# Altium project Electrode_Breakout.PrjPcb
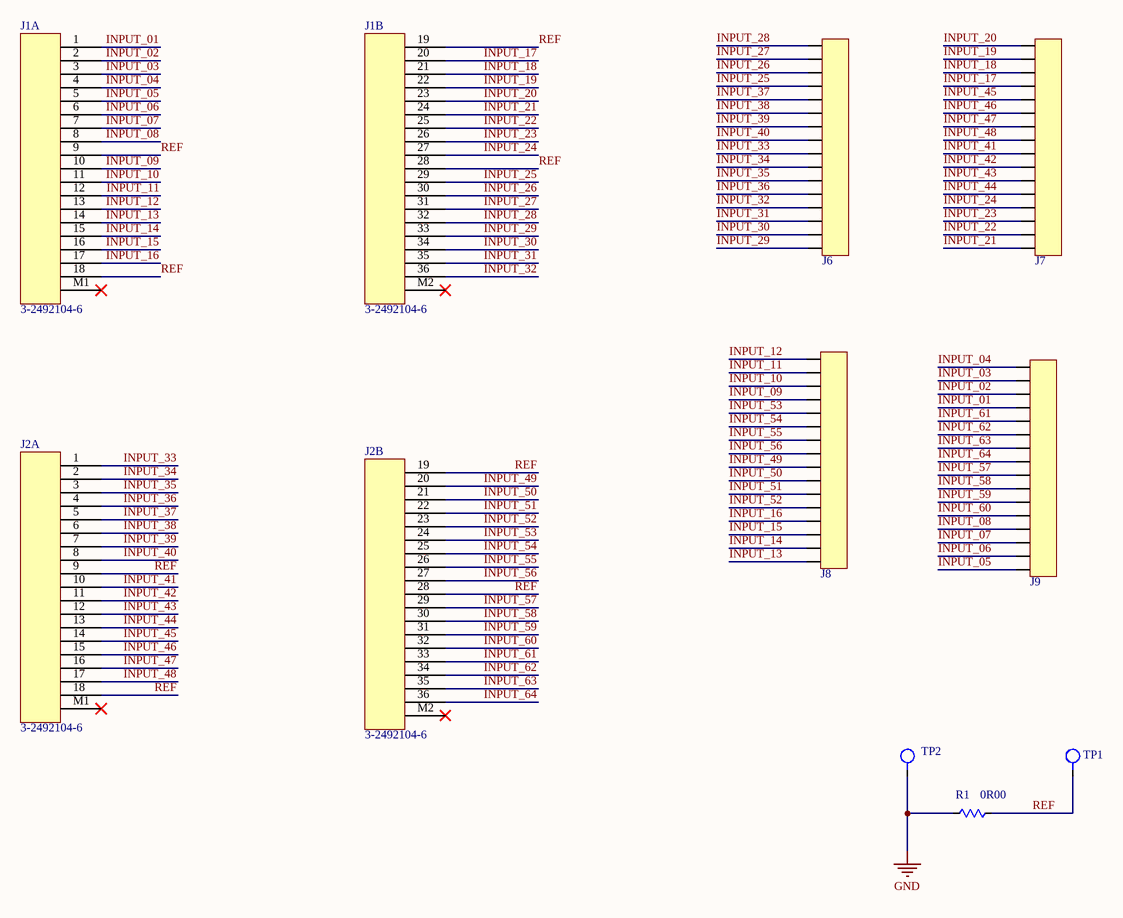
[diagram p0: Electrode_Breakout.SchDoc]
Project_Stencil_Top_Thickness: 0.1 MM; Project_Stencil_Bot_Thickness: 0.1 MM; Project_Revision: 1.000; Project_Name: Electrode Breakout; Project_Group: SBioML; Project_Global: UHDEMG; Project_Designer4: Enter Name; Project_Designer3: Enter Name; Project_Designer2: Enter Name; Project_Designer1: Olivier Bergeron; Project_DateCode: DC260901; Project_Date: 2026-09-01
1 sheet, 9 parts. Net scope: flat (ports and power ports of the same name join across sheets).
Board file: Electrode_Breakout.PcbDoc

## Sheet Electrode_Breakout.SchDoc
size Tabloid; SheetNumber: 1; SheetTotal: 1; Sheet_Name: Electrode Breakout; Size: 11x17

### Parts
J1  3-2492104-6  [CON_ZIF_RA_36POS]  (parts A,B of 2)
J2  3-2492104-6  [CON_ZIF_RA_36POS]  (parts A,B of 2)
J6  CON_HEADER_16  [CON_HEADER_16]  (value not drawn)
J7  CON_HEADER_16  [CON_HEADER_16]  (value not drawn)
J8  CON_HEADER_16  [CON_HEADER_16]  (value not drawn)
J9  CON_HEADER_16  [CON_HEADER_16]  (value not drawn)
R1  0R00  [0402_Resistor]
TP1  TP_Small  [TP_Small_M2]  (value not drawn)
TP2  TP_Small  [TP_Small_M2]  (value not drawn)

### Nets
GND: R1.1 TP2.1
INPUT_01: J1.1 J9.4
INPUT_02: J1.2 J9.3
INPUT_03: J1.3 J9.2
INPUT_04: J1.4 J9.1
INPUT_05: J1.5 J9.16
INPUT_06: J1.6 J9.15
INPUT_07: J1.7 J9.14
INPUT_08: J1.8 J9.13
INPUT_09: J1.10 J8.4
INPUT_10: J1.11 J8.3
INPUT_11: J1.12 J8.2
INPUT_12: J1.13 J8.1
INPUT_13: J1.14 J8.16
INPUT_14: J1.15 J8.15
INPUT_15: J1.16 J8.14
INPUT_16: J1.17 J8.13
INPUT_17: J1.20 J7.4
INPUT_18: J1.21 J7.3
INPUT_19: J1.22 J7.2
INPUT_20: J1.23 J7.1
INPUT_21: J1.24 J7.16
INPUT_22: J1.25 J7.15
INPUT_23: J1.26 J7.14
INPUT_24: J1.27 J7.13
INPUT_25: J1.29 J6.4
INPUT_26: J1.30 J6.3
INPUT_27: J1.31 J6.2
INPUT_28: J1.32 J6.1
INPUT_29: J1.33 J6.16
INPUT_30: J1.34 J6.15
INPUT_31: J1.35 J6.14
INPUT_32: J1.36 J6.13
INPUT_33: J2.1 J6.9
INPUT_34: J2.2 J6.10
INPUT_35: J2.3 J6.11
INPUT_36: J2.4 J6.12
INPUT_37: J2.5 J6.5
INPUT_38: J2.6 J6.6
INPUT_39: J2.7 J6.7
INPUT_40: J2.8 J6.8
INPUT_41: J2.10 J7.9
INPUT_42: J2.11 J7.10
INPUT_43: J2.12 J7.11
INPUT_44: J2.13 J7.12
INPUT_45: J2.14 J7.5
INPUT_46: J2.15 J7.6
INPUT_47: J2.16 J7.7
INPUT_48: J2.17 J7.8
INPUT_49: J2.20 J8.9
INPUT_50: J2.21 J8.10
INPUT_51: J2.22 J8.11
INPUT_52: J2.23 J8.12
INPUT_53: J2.24 J8.5
INPUT_54: J2.25 J8.6
INPUT_55: J2.26 J8.7
INPUT_56: J2.27 J8.8
INPUT_57: J2.29 J9.9
INPUT_58: J2.30 J9.10
INPUT_59: J2.31 J9.11
INPUT_60: J2.32 J9.12
INPUT_61: J2.33 J9.5
INPUT_62: J2.34 J9.6
INPUT_63: J2.35 J9.7
INPUT_64: J2.36 J9.8
REF: J1.9 J1.18 J1.19 J1.28 J2.9 J2.18 J2.19 J2.28 R1.2 TP1.1

Not connected (* = marked no-connect by the designer): J1 M1* M2*; J2 M1* M2*

### Notes on the sheet
- Sheet Name
- Project Title
- Global Project
- Size
- Group
- Revision
- Date
- Sheet
- of
- Filename
- Designers

### Library data of the parts
J1 J2 = CON_ZIF_RA_36POS: 36 Position FPC Connector Contacts, Bottom 0.020" (0.50mm) Surface Mount, Right Angle; GRAMS Lib Spec: 2.7
R1 = Resistor: GRAMS Lib Spec: 2.7
TP1 TP2 = TP_Small: Through Hole Test Point - M2